# EasyEDA schematic SCH_Ribery_MotherBoard_2024-03-02.json
TITLE: Motherboard; REV: 1.0; Date: 2023-09-06; Sheet: 1/1; Drawn By: Fran Gómez; Company: fr4321gm
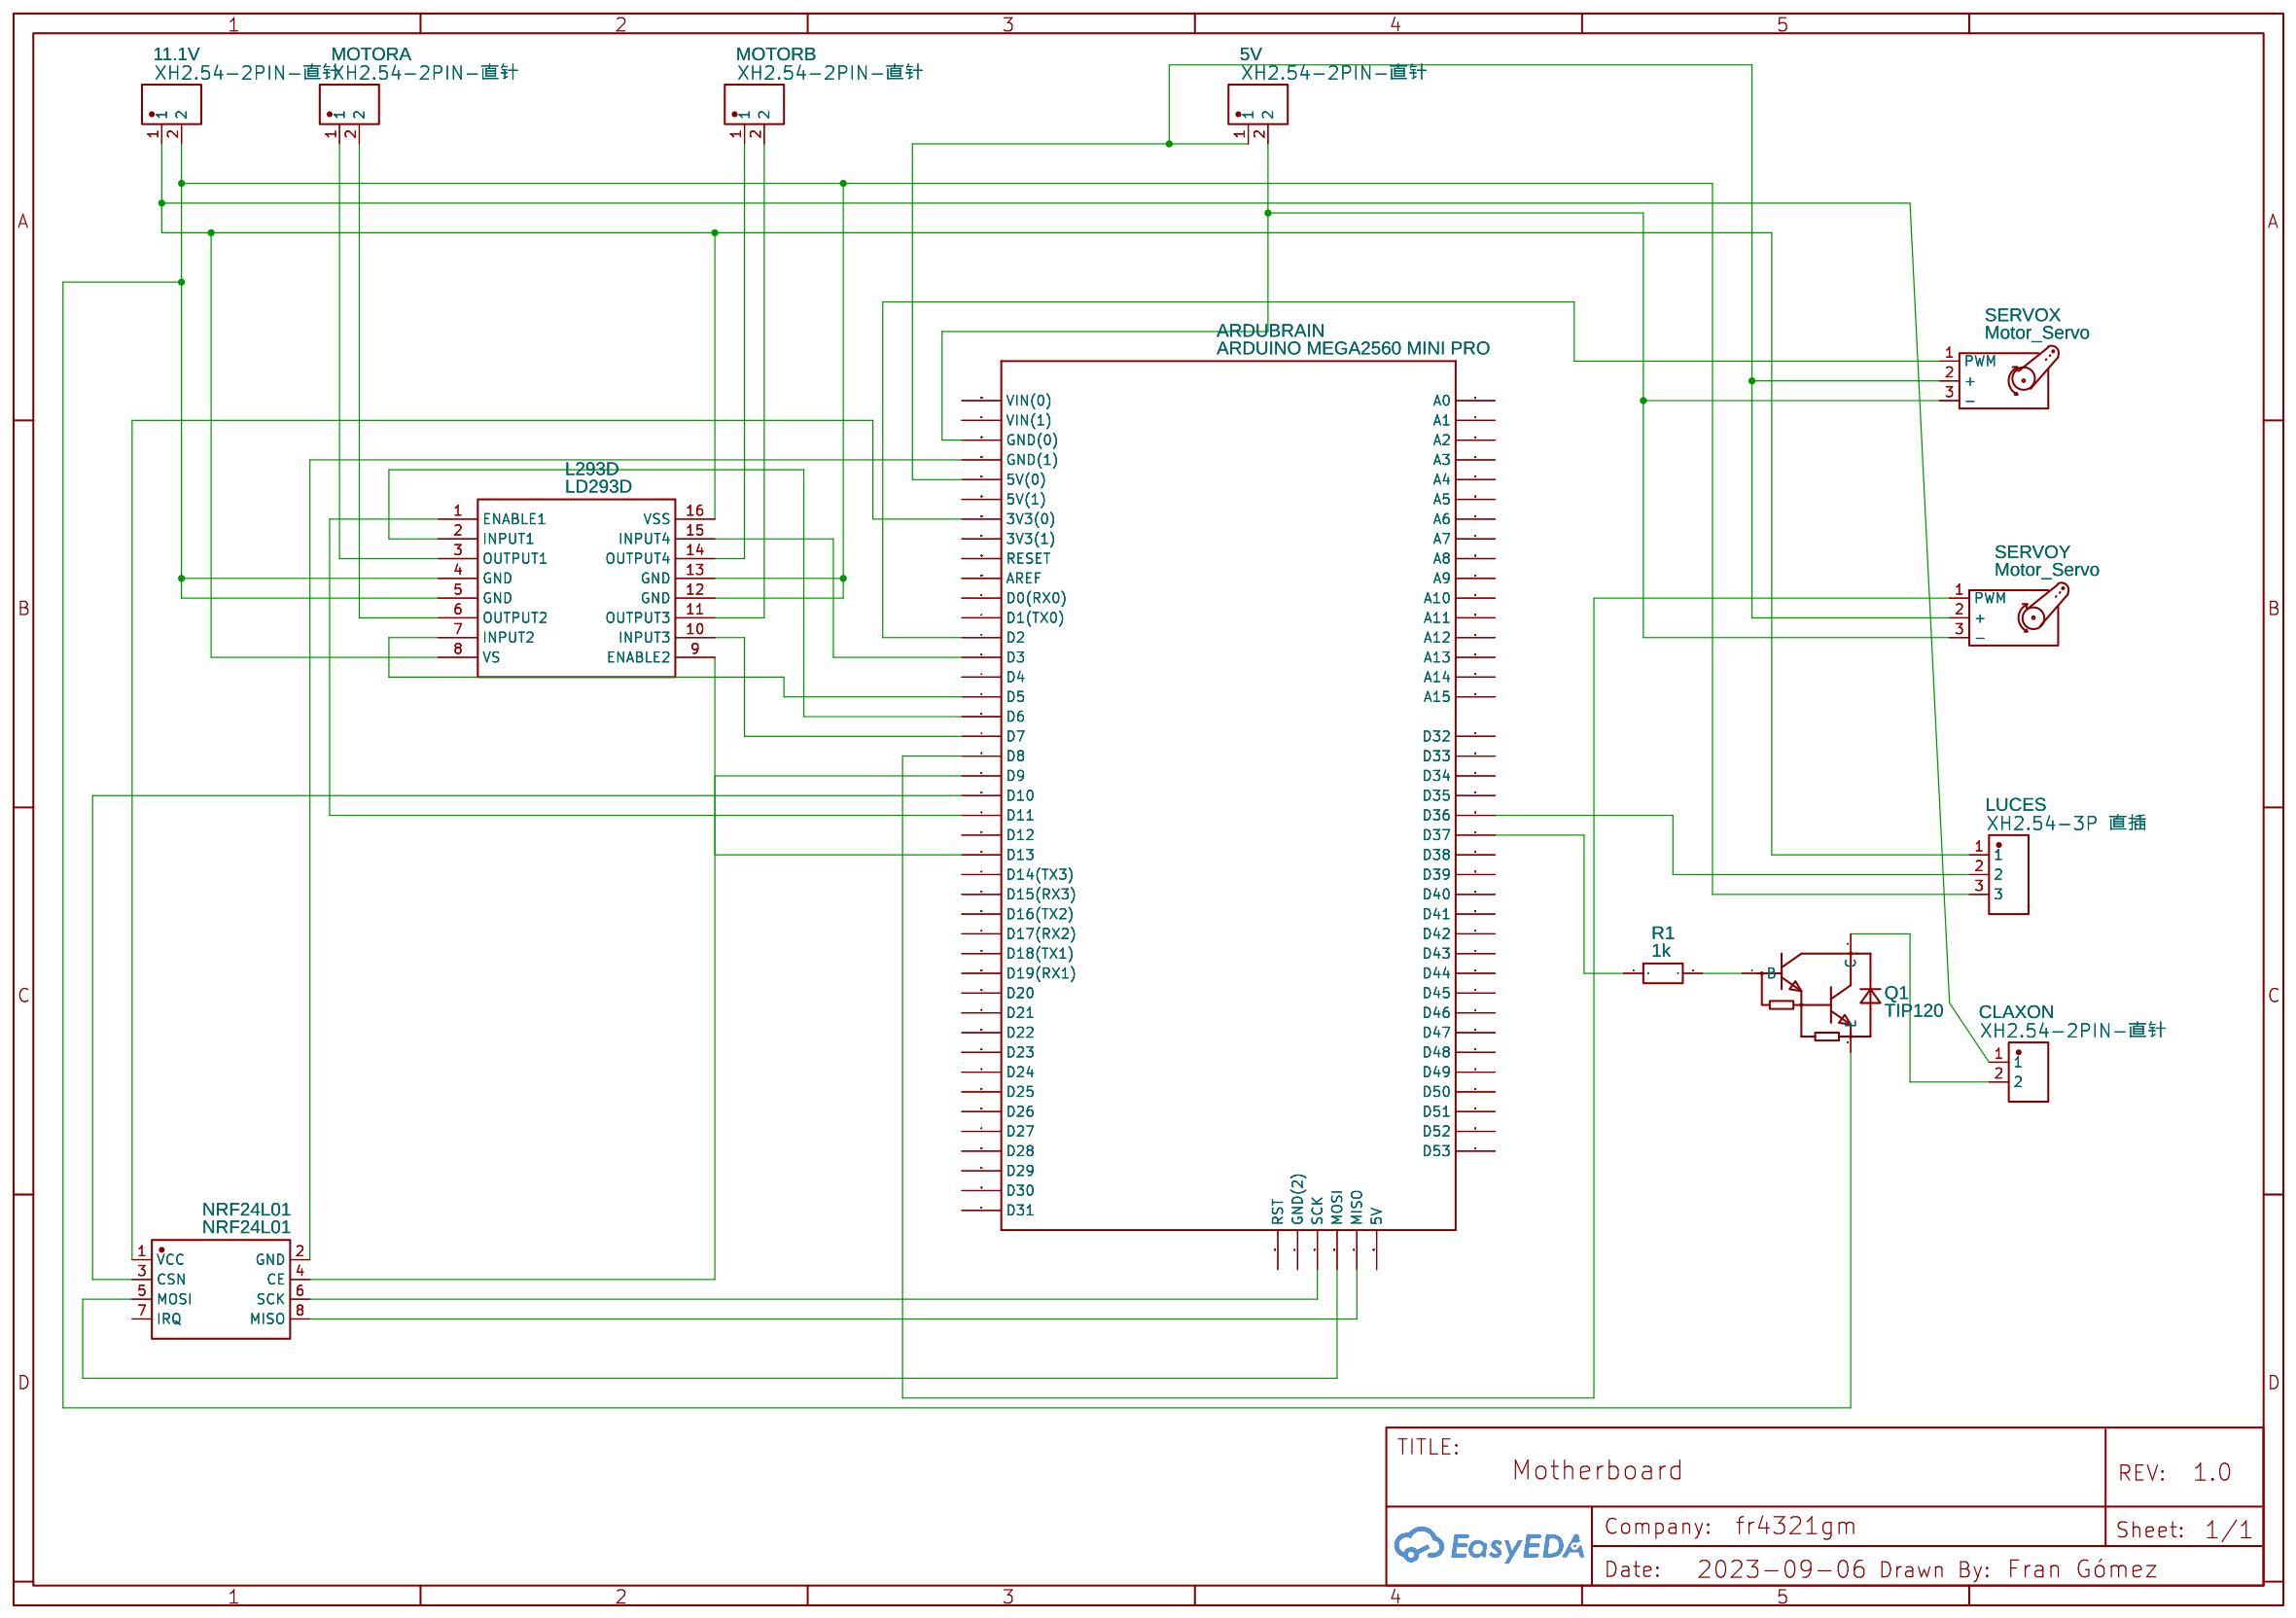
[diagram p0: schematic sheet]

## Parts
5V  XH2.54-2PIN-直针  [CONN-TH_XH2.54-2P]
11.1V  XH2.54-2PIN-直针  [CONN-TH_XH2.54-2P]
ARDUBRAIN  ARDUINO MEGA2560 MINI PRO  [ARDUINO MEGA2560 MINI PRO]
CLAXON  XH2.54-2PIN-直针  [CONN-TH_XH2.54-2P]
L293D  LD293D  [DIP-16_L20.0-W6.4-P2.54-LS7.6-BL]
LUCES  XH2.54-3P 直插  [CONN-TH_XH2.54-3P]
MOTORA  XH2.54-2PIN-直针  [CONN-TH_XH2.54-2P]
MOTORB  XH2.54-2PIN-直针  [CONN-TH_XH2.54-2P]
NRF24L01  NRF24L01  [WIRELM-SMD_NRF24L01]
Q1  TIP120  [TO-220-3_L10.0-W4.5-P2.54-L]
R1  1k  [R_AXIAL-0.3]
SERVOX  Motor_Servo  [CONN-TH_XH2.54-3P]
SERVOY  Motor_Servo  [CONN-TH_XH2.54-3P]

## Library data of the parts
5V 11.1V CLAXON MOTORA MOTORB = XH2.54-2PIN-直针: Contributor: LCSC; Supplier: LCSC; Supplier Part: C9900011425; Manufacturer: null; JLCPCB Part Class: Extended Part; link: https://lcsc.com/eda_search?q=C9900011425&%26type=1&ref=editor
ARDUBRAIN = ARDUINO MEGA2560 MINI PRO: Contributor: indahhtrw
L293D = LD293D///2: Contributor: pitreluc; Supplier: LCSC; Manufacturer: STMicroelectronics; Supplier Part: C12340; JLCPCB Part Class: Extended Part
LUCES = XH2.54-3P 直插: Contributor: LCSC; Supplier: LCSC; Supplier Part: C9900000727; Manufacturer: null; JLCPCB Part Class: Extended Part; link: https://lcsc.com/eda_search?q=C9900000727&%26type=1&ref=editor
NRF24L01 = NRF24L01: Supplier: LCSC; Manufacturer: Ai-Thinker(安信可); Manufacturer Part: NF-04; Supplier Part: C90751; JLCPCB Part Class: Extended Part; link: https://lcsc.com/eda_search?q=C90751&%26type=1&ref=editor
Q1 = TIP120: Contributor: LCSC; Supplier: LCSC; Supplier Part: C262990; Manufacturer: ST(意法半导体); JLCPCB Part Class: Extended Part; link: https://lcsc.com/eda_search?q=C262990&%26type=1&ref=editor
R1 = R_AXIAL-0.3_EU: Contributor: LCEDA_Lib
SERVOX SERVOY = Motor_Servo: Contributor: KiCAD; license: https://www.gnu.org/licenses/lgpl-2.1.html

## Nets
Net-(5V-1): 5V.1 ARDUBRAIN.104(5V(0)) SERVOX.2(+) SERVOY.2(+)
Net-(5V-2): 5V.2 ARDUBRAIN.102(GND(0)) SERVOX.3(-) SERVOY.3(-)
Net-(11.1V-1): 11.1V.1 CLAXON.1 L293D.8(VS) L293D.16(VSS) LUCES.1
Net-(11.1V-2): 11.1V.2 L293D.4(GND) L293D.5(GND) L293D.12(GND) L293D.13(GND) LUCES.3 Q1.3(E)
Net-(ARDUBRAIN-2): ARDUBRAIN.2(D2) SERVOX.1(PWM)
Net-(ARDUBRAIN-3): ARDUBRAIN.3(D3) L293D.15(INPUT4)
Net-(ARDUBRAIN-5): ARDUBRAIN.5(D5) L293D.7(INPUT2)
Net-(ARDUBRAIN-6): ARDUBRAIN.6(D6) L293D.2(INPUT1)
Net-(ARDUBRAIN-7): ARDUBRAIN.7(D7) L293D.10(INPUT3)
Net-(ARDUBRAIN-8): ARDUBRAIN.8(D8) SERVOY.1(PWM)
Net-(ARDUBRAIN-9): ARDUBRAIN.9(D9) NRF24L01.4(CE)
Net-(ARDUBRAIN-10): ARDUBRAIN.10(D10) NRF24L01.3(CSN)
Net-(ARDUBRAIN-11): ARDUBRAIN.11(D11) L293D.1(ENABLE1)
Net-(ARDUBRAIN-13): ARDUBRAIN.13(D13) L293D.9(ENABLE2)
Net-(ARDUBRAIN-36): ARDUBRAIN.36(D36) LUCES.2
Net-(ARDUBRAIN-37): ARDUBRAIN.37(D37) R1.1
Net-(ARDUBRAIN-103): ARDUBRAIN.103(GND(1)) NRF24L01.2(GND)
Net-(ARDUBRAIN-106): ARDUBRAIN.106(3V3(0)) NRF24L01.1(VCC)
Net-(ARDUBRAIN-111): ARDUBRAIN.111(MISO) NRF24L01.8(MISO)
Net-(ARDUBRAIN-112): ARDUBRAIN.112(MOSI) NRF24L01.5(MOSI)
Net-(ARDUBRAIN-113): ARDUBRAIN.113(SCK) NRF24L01.6(SCK)
Net-(CLAXON-2): CLAXON.2 Q1.2(C)
Net-(L293D-3): L293D.3(OUTPUT1) MOTORA.1
Net-(L293D-6): L293D.6(OUTPUT2) MOTORA.2
Net-(L293D-11): L293D.11(OUTPUT3) MOTORB.2
Net-(L293D-14): L293D.14(OUTPUT4) MOTORB.1
Net-(Q1-1): Q1.1(B) R1.2

Not connected (* = marked no-connect by the designer): ARDUBRAIN 0(D0(RX0)) 1(D1(TX0)) 4(D4) 12(D12) 14(D14(TX3)) 15(D15(RX3)) 16(D16(TX2)) 17(D17(RX2)) 18(D18(TX1)) 19(D19(RX1)) 20(D20) 21(D21) 22(D22) 23(D23) 24(D24) 25(D25) 26(D26) 27(D27) 28(D28) 29(D29) 30(D30) 31(D31) 32(D32) 33(D33) 34(D34) 35(D35) 38(D38) 39(D39) 40(D40) 41(D41) 42(D42) 43(D43) 44(D44) 45(D45) 46(D46) 47(D47) 48(D48) 49(D49) 50(D50) 51(D51) 52(D52) 53(D53) 54(A0) 55(A1) 56(A2) 57(A3) 58(A4) 59(A5) 60(A6) 61(A7) 62(A8) 63(A9) 64(A10) 65(A11) 66(A12) 67(A13) 68(A14) 69(A15) 100(VIN(0)) 101(VIN(1)) 105(5V(1)) 107(3V3(1)) 108(RESET) 109(AREF) 110(5V) 114(GND(2)) 115(RST); NRF24L01 7(IRQ)
